# EAGLE design PiZeroHub (EAGLE 6.4)
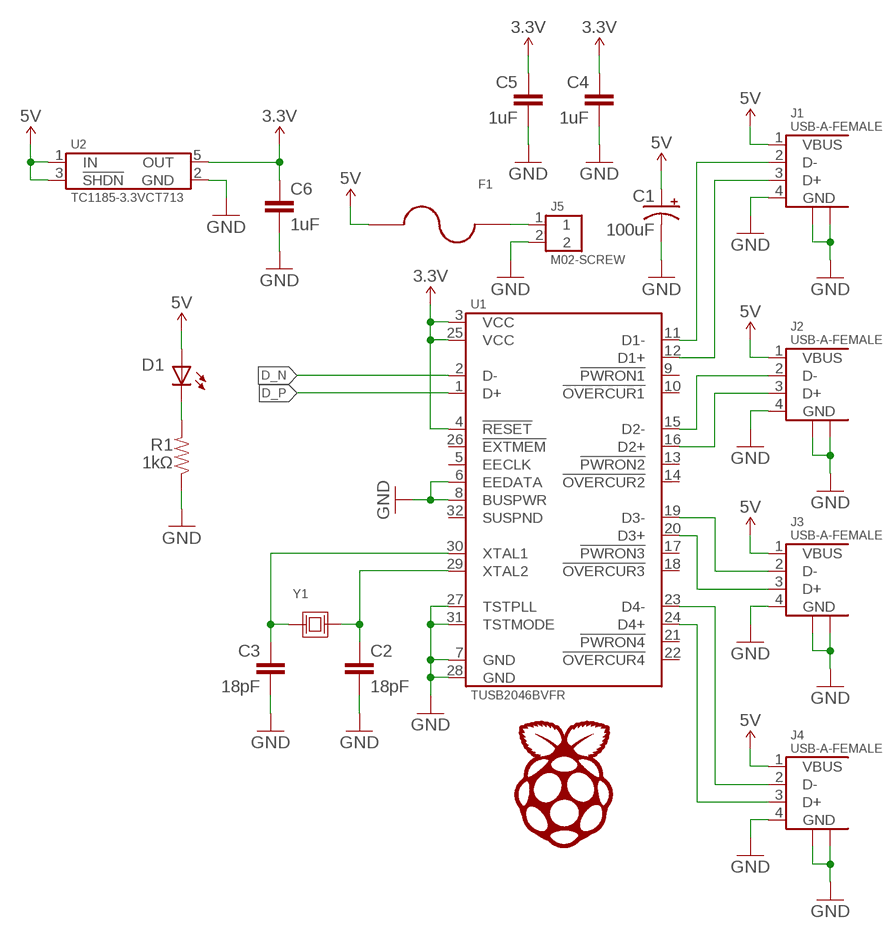
[diagram p0: schematic, sheet 1]

## Parts
C1  100uF  CAP_POL-6.6X6.6  [CAP_POL-6.6X6.6]
C2  18pF  CAP-0805  [0805-CAP]
C3  18pF  CAP-0805  [0805-CAP]
C4  1uF  CAP-0805  [0805-CAP]
C5  1uF  CAP-0805  [0805-CAP]
C6  1uF  CAP-0805  [0805-CAP]
D1  LED-0805  [0805-LED]
F1  PTC-1812  [1812-PTC]
J1  USB-A-FEMALE  [USB-A-FEMALE]
J2  USB-A-FEMALE  [USB-A-FEMALE]
J3  USB-A-FEMALE  [USB-A-FEMALE]
J4  USB-A-FEMALE  [USB-A-FEMALE]
J5  M02-SCREW  [M02-SCREW]
R1  1kΩ  RESISTOR-0805  [0805-RES]
U1  TUSB2046BVFR  [LQFP-32]
U2  TC1185-3.3VCT713  [SOT23-5]
U$1  RPI-ZERO_NOPAD  [RPI_ZERO-NOPADS]
Y1  CRYSTAL2-HC49  [HC49/US]

## Nets
3.3V: C4.1 C5.1 C6.1 U1.3(VCC) U1.4(!RESET) U1.25(VCC) U2.5(OUT)
5V: C1.+ D1.A F1.2 J1.1(VBUS) J2.1(VBUS) J3.1(VBUS) J4.1(VBUS) U2.1(IN) U2.3(!SHDN)
D1_N: J1.2(D-) U1.11(D1-)
D1_P: J1.3(D+) U1.12(D1+)
D2_N: J2.2(D-) U1.15(D2-)
D2_P: J2.3(D+) U1.16(D2+)
D3_N: J3.2(D-) U1.19(D3-)
D3_P: J3.3(D+) U1.20(D3+)
D4_N: J4.2(D-) U1.23(D4-)
D4_P: J4.3(D+) U1.24(D4+)
D_N: U1.2(D-)
D_P: U1.1(D+)
GND: C1.- C2.2 C3.2 C4.2 C5.2 C6.2 J1.4(GND) J1.P$1 J1.P$2 J2.4(GND) J2.P$1 J2.P$2 J3.4(GND) J3.P$1 J3.P$2 J4.4(GND) J4.P$1 J4.P$2 J5.2 R1.1 U1.6(EEDATA) U1.7(GND) U1.8(BUSPWR) U1.27(TSTPLL) U1.28(GND) U1.31(TSTMODE) U2.2(GND)
N$5: D1.C R1.2
N$9: F1.1 J5.1
N$10: C3.1 U1.30(XTAL1) Y1.1
N$11: C2.1 U1.29(XTAL2) Y1.2
Unconnected: U1.5(EECLK) U1.9(!PWRON1) U1.10(!OVERCUR1) U1.13(!PWRON2) U1.14(!OVERCUR2) U1.17(!PWRON3) U1.18(!OVERCUR3) U1.21(!PWRON4) U1.22(!OVERCUR4) U1.26(!EXTMEM) U1.32(SUSPND)

## Library data of the parts
C1 = Passives:CAP_POL
C2-C6 = Passives:CAP
D1 = Passives:LED
F1 = Passives:PTC
J1-J4 = Connectors:USB
J5 = Connectors:M02
R1 = Passives:RESISTOR
U1 = TI:TUSB2046
U2 = Microchip:TC1185
U$1 = Passives:RPI
Y1 = Passives:CRYSTAL2

## Board
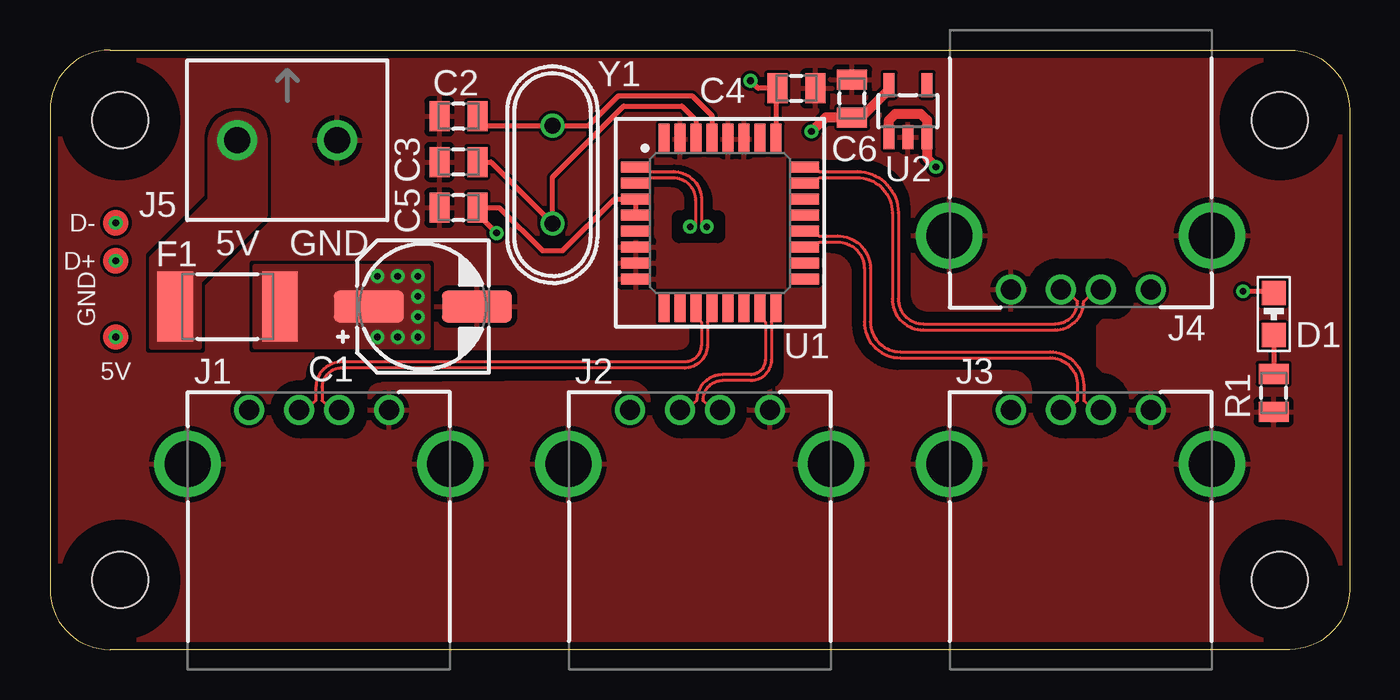
[diagram p1: board, top side]
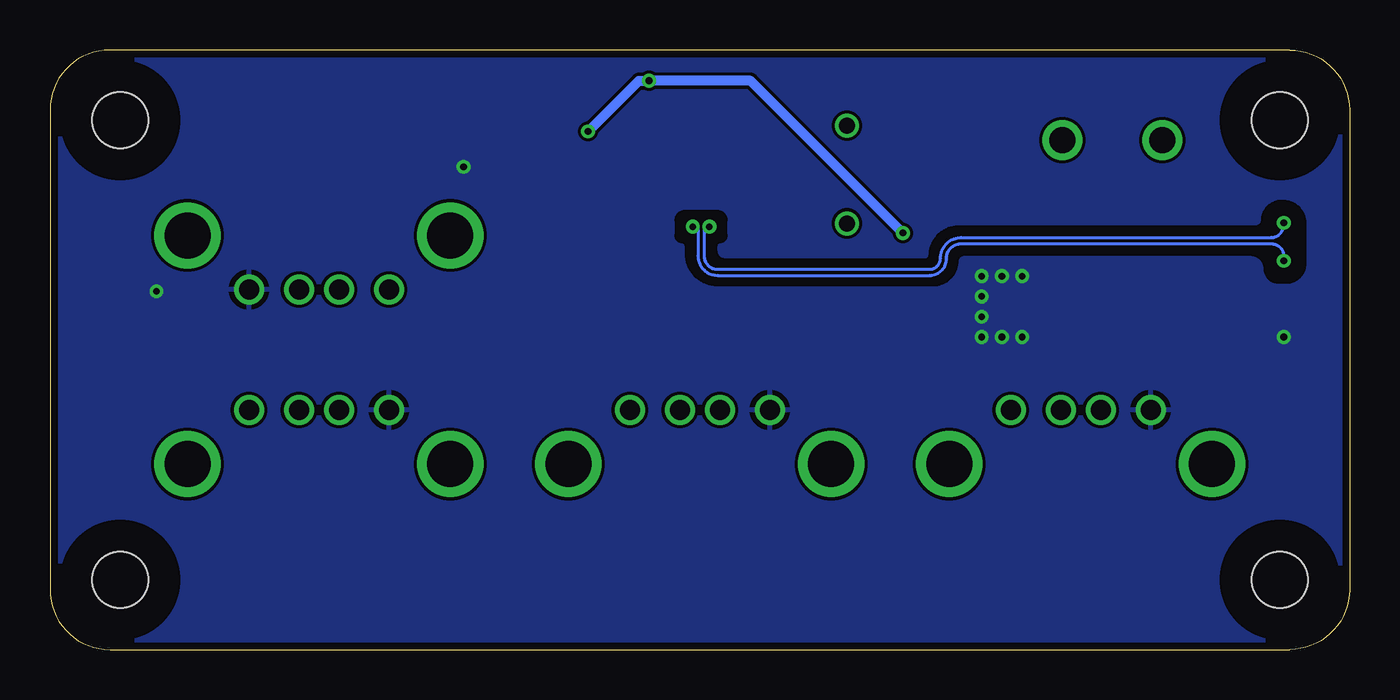
[diagram p2: board, bottom side, seen from below]

Size 65 x 30 mm. Coordinates in mm from the lower left corner, seen from the top.
Copper layers (1*16): Top 0.0356mm / dielectric 1.5011mm / Bottom 0.0356mm
Design rules "oshpark-2layer *": minimum track width 6mil, minimum drill 13mil, track to track 6mil, track to pad 6mil, pad to pad 6mil, via to via 6mil, smd to smd 6mil, copper to edge 15mil, drill to drill 6mil, minimum pad ring 7mil, minimum via ring 7mil, stop-mask expansion 4mil, vias tented up to drill 20mil, thermal gap 10mil

### Footprints (pad centres in the part's own frame; a part is rotated, then mirrored left to right if it is on the bottom)
CAP_POL-6.6X6.6 = smd 1.6 x 3.5: + 0,2.7; - 0,-2.7
0805-CAP = smd 1 x 1.5: 1 -0.95,0; 2 0.95,0
0805-LED = smd 1.2 x 1.2: A -1.05,0; C 1.05,0
1812-PTC = smd 1.78 x 3.5: 1 -2.615,0; 2 2.615,0
USB-A-FEMALE = drill 1: 1 -3.5,2.71; 2 -1,2.71; 3 1,2.71; 4 3.5,2.71 | drill 2.3: P$1 6.57,0; P$2 -6.57,0
M02-SCREW = drill 1.3 pad 2: 1 -2.5,0; 2 2.5,0
0805-RES = smd 1 x 1.5: 1 -0.95,0; 2 0.95,0
LQFP-32 = smd 1.5 x 0.55: 1 -4.2,2.8; 2 -4.2,2; 3 -4.2,1.2; 4 -4.2,0.4; 5 -4.2,-0.4; 6 -4.2,-1.2; 7 -4.2,-2; 8 -4.2,-2.8; 17 4.2,-2.8; 18 4.2,-2; 19 4.2,-1.2; 20 4.2,-0.4; 21 4.2,0.4; 22 4.2,1.2; 23 4.2,2; 24 4.2,2.8 | smd 0.55 x 1.5: 9 -2.8,-4.2; 10 -2,-4.2; 11 -1.2,-4.2; 12 -0.4,-4.2; 13 0.4,-4.2; 14 1.2,-4.2; 15 2,-4.2; 16 2.8,-4.2; 25 2.8,4.2; 26 2,4.2; 27 1.2,4.2; 28 0.4,4.2; 29 -0.4,4.2; 30 -1.2,4.2; 31 -2,4.2; 32 -2.8,4.2
SOT23-5 = smd 1.2 x 0.55: 1 1.3,-0.95; 2 1.3,0; 3 1.3,0.95; 4 -1.3,0.95; 5 -1.3,-0.95
RPI_ZERO-NOPADS = hole 2.8: 29,11.5; -29,11.5; 29,-11.5; -29,-11.5
HC49/US = drill 0.8: 1 -2.44,0; 2 2.44,0

### Placement (x,y rotation side)
C1  18.66,17.16 90 top
C2  20.44,26.68 180 top
C3  20.44,24.4 180 top
C4  37.33,28.08 0 top
C5  20.44,22.11 180 top
C6  40.12,27.57 90 top
D1  61.2,16.78 270 top
F1  8.88,17.16 0 top
J1  13.45,9.29 0 top
J2  32.5,9.29 0 top
J3  51.55,9.29 0 top
J4  51.55,20.71 180 top
J5  11.86,25.48 0 top
R1  61.2,12.84 90 top
U1  33.52,21.35 0 top
U2  42.91,26.94 270 top
U$1  32.5,15 0 top
Y1  25.13,23.76 90 top

### Tracks (layer width: path | path; a pad name or v marks a point on that pad's centre or on a via)
3.3V  (via drill 0.33)
  Top 0.254: U1.25 36.32,28.02 C4.1 35.42,28.08 v35.04,28.46 | U1.4 U1.3 28.24,22.55 25.64,19.95 24.63,19.95 22.47,22.11 C5.1 21.38,21.8 v22.34,20.84
  Top 0.508: U2.5 41.96,28.02 40.57,26.62 C6.1 38.79,26.62 v38.09,25.92
  Bottom 0.508: v38.09,25.92 35.55,28.46 v35.04,28.46 29.96,28.46 v22.34,20.84
5V  (via drill 0.33)
  Top 0.254: D1.A arc90 61.11,17.92 v59.68,17.92
  Top 0.508: U2.1 41.96,26.5 42.28,26.81 43.55,26.81 43.86,26.5 U2.3 43.86,24.59 v44.31,24.14
  other vias: 16.37,15.63 17.39,15.63 18.4,15.63 18.4,16.65 18.4,17.67 18.4,18.68 17.39,18.68 16.37,18.68 3.29,15.63
  pour Top (no thermals): 10.27,19.19 18.91,19.19 18.91,15.13 10.27,15.13
  pour Bottom: -1.16,31.51 66.16,31.51 66.16,-1.51 -1.16,-1.51
D1_N
  Top 0.152: U1.11 32.32,16.66 32.58,16.4 32.58,15.23 arc-90 31.74,14.39 14.59,14.39 arc90 13.3,13.1 13.3,12.46 12.83,12 J1.2
D1_P
  Top 0.152: U1.12 33.12,16.63 32.88,16.4 32.88,15.23 arc-90 31.74,14.09 14.59,14.09 arc90 13.6,13.1 13.6,12.46 14.07,12 J1.3
D2_N
  Top 0.152: U1.15 35.52,16.66 35.78,16.4 35.78,14.49 arc-90 35.04,13.75 33.64,13.75 arc90 32.35,12.46 31.88,12 J2.2
D2_P
  Top 0.152: U1.16 36.32,16.63 36.08,16.4 36.08,14.49 arc-90 35.04,13.45 33.64,13.45 arc90 32.65,12.46 33.12,12 J2.3
D3_N
  Top 0.152: U1.19 38.23,20.15 38.47,20.38 39.41,20.38 arc-90 40.73,19.06 40.73,16.4 arc90 42.53,14.59 50.03,14.59 arc-90 51.4,13.22 51.4,12.46 50.93,12 J3.2
D3_P
  Top 0.152: U1.20 38.21,20.95 38.47,20.69 39.41,20.69 arc-90 41.03,19.06 41.03,16.4 arc90 42.53,14.9 50.03,14.9 arc-90 51.7,13.22 51.7,12.46 52.17,12 J3.3
D4_N
  Top 0.152: U1.23 38.21,23.35 38.47,23.61 40.37,23.61 arc-90 42.13,21.86 42.13,17.54 arc90 43.68,15.99 50.28,15.99 arc90 51.7,17.41 52.29,18 J4.2
D4_P
  Top 0.152: U1.24 38.23,24.15 38.47,23.91 40.37,23.91 arc-90 42.43,21.86 42.43,17.54 arc90 43.68,16.3 50.28,16.3 arc90 51.4,17.41 50.81,18 J4.3
D_N  (via drill 0.33)
  Top 0.152: U1.2 29.76,23.35 30.02,23.61 31.17,23.61 arc-90 32.28,22.49 32.28,21.16 v32.02,21.16
  Bottom 0.152: v32.02,21.16 32.28,21.16 32.28,19.7 arc-90 31.61,19.03 21.01,19.03 arc-90 20.46,19.57 arc90 19.42,20.61 3.93,20.61 arc-90 3.29,21.25 v3.29,21.35
D_P  (via drill 0.33)
  Top 0.152: U1.1 29.79,24.15 30.02,23.91 31.17,23.91 arc-90 32.59,22.49 32.59,21.16 v32.86,21.16
  Bottom 0.152: v32.86,21.16 32.59,21.16 32.59,19.7 arc-90 31.61,18.72 21.01,18.72 arc-90 20.16,19.57 arc90 19.42,20.31 3.93,20.31 arc90 3.29,19.67 v3.29,19.45
GND
  pour Top (rank 2): -0.52,30.88 65.52,30.88 65.52,-0.88 -0.52,-0.88
N$1
  cutout Top: 43.93,16.78 48.36,16.78 arc90 49.01,17.43 49.01,18.05 arc-90 50.41,19.45 52.82,19.45 arc-90 54.09,18.18 54.09,17.55 arc-90 53.19,16.65 52.57,16.65 52.19,16.27 52.19,14.11 52.57,13.73 arc-90 53.84,12.46 53.84,12.21 arc-90 52.31,10.68 50.79,10.68 arc-90 49.26,12.21 49.26,12.97 arc90 48.12,14.11 42.41,14.11 arc-90 40.25,16.27 40.25,18.81 arc90 39.1,19.95 37.58,19.95 37.58,23.37 arc-90 38.6,24.4 40.5,24.4 arc-90 42.91,22.11 42.91,17.79 arc90
N$2
  cutout Top: 32.88,17.41 35.8,17.41 arc-90 36.56,16.65 36.56,13.93 arc-90 35.73,13.1 arc93 34.72,12.03 34.72,11.89 arc-93 33.58,10.68 31.61,10.68 arc-90 30.21,12.08 30.21,12.33 arc91 28.93,13.6 16.5,13.48 arc90 15.74,12.71 15.74,11.7 arc-90 14.72,10.68 12.56,10.68 arc-90 11.16,12.08 arc-90 12.43,13.35 12.56,13.35 arc90 12.94,13.73 arc-90 14.09,14.87 31.48,14.87 arc90 32.12,15.51 32.12,16.65 arc-90
N$3
  cutout Bottom: 31.23,20.71 31.23,21.48 arc-90 31.61,21.86 33.26,21.86 arc-90 33.64,21.48 33.64,20.71 arc-90 33.39,20.46 arc90 33.13,20.21 33.13,19.83 arc-90 31.61,18.3 20.82,18.3 arc-90 19.67,19.45 arc90 19.29,19.83 4.94,19.83 arc90 4.18,19.06 arc-90 3.54,18.43 3.16,18.43 arc-90 2.27,19.32 2.27,21.35 arc-90 3.29,22.37 3.42,22.37 arc-90 4.31,21.48 arc90 4.69,21.1 19.55,21.1 arc-90 20.94,19.7 arc90 21.2,19.45 31.23,19.45 arc90 31.74,19.95 31.74,20.21 arc90 31.48,20.46 arc-90
N$4
  cutout Top: 29.45,24.14 31.23,24.14 arc-90 33.01,22.37 33.01,22.11 arc90 33.26,21.86 33.39,21.86 arc-90 33.64,21.6 33.64,20.71 arc-90 33.39,20.46 31.48,20.46 arc-90 31.23,20.71 31.23,21.6 arc-90 31.48,21.86 31.61,21.86 arc90 31.86,22.11 31.86,22.49 arc90 31.1,23.26 29.45,23.26
N$5
  Top 0.254: D1.C R1.2
N$9
  pour Top (no thermals): 10.78,21.73 10.78,25.41 arc90 9.39,26.81 arc90 7.99,25.41 7.99,22.49 5.07,19.57 5.07,15.13 7.48,15.13 7.48,18.43
N$10
  Top 0.254: U1.30 32.32,26.49 31.61,27.19 28.69,27.19 25.13,23.64 Y1.1 22.06,24.4 C3.1
N$11
  Top 0.254: C2.1 21.24,26.2 Y1.2 26.94,26.2 28.44,27.7 32.12,27.7 33.12,26.7 U1.29
(copper drawn outside any net)
  shapes: Top circle x3

### Text on the board
tPlace: D- | 5V | GND | D+ | GND | 5V